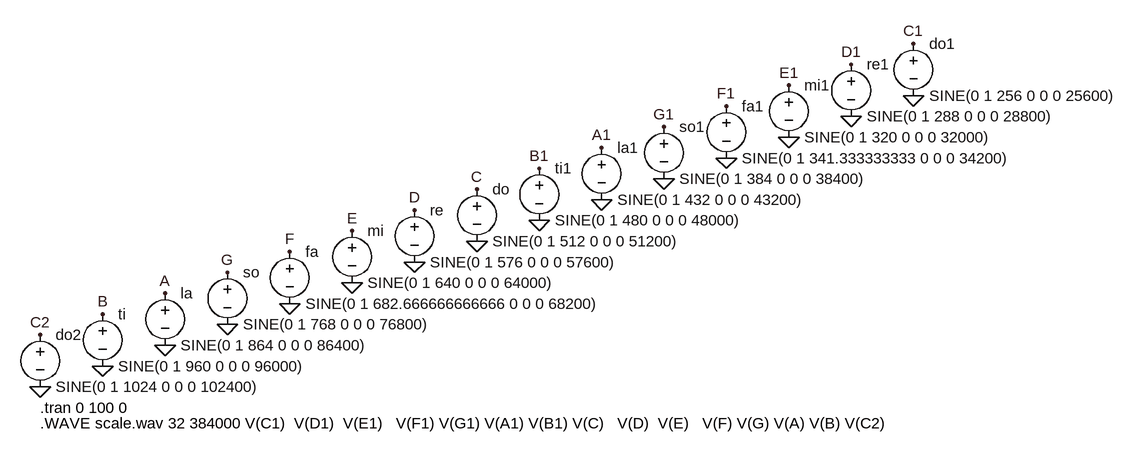
[diagram p0: schematic 2scales.asc]
2scales.asc, the LTspice schematic file:
Version 4
SHEET 1 1104 768
FLAG 96 416 0
FLAG 96 336 C
FLAG 0 368 D
FLAG -96 480 0
FLAG -96 400 E
FLAG -192 432 F
FLAG -288 544 0
FLAG -288 464 G
FLAG -384 496 A
FLAG -480 608 0
FLAG -480 528 B
FLAG -576 560 C2
FLAG 0 448 0
FLAG -192 512 0
FLAG -576 640 0
FLAG -384 576 0
FLAG 768 192 0
FLAG 768 112 C1
FLAG 672 144 D1
FLAG 576 256 0
FLAG 576 176 E1
FLAG 480 208 F1
FLAG 384 320 0
FLAG 384 240 G1
FLAG 288 272 A1
FLAG 192 384 0
FLAG 192 304 B1
FLAG 672 224 0
FLAG 480 288 0
FLAG 288 352 0
SYMBOL voltage 96 320 R0
WINDOW 123 0 0 Left 0
WINDOW 39 0 0 Left 0
SYMATTR InstName do
SYMATTR Value SINE(0 1 512 0 0 0 51200)
SYMBOL voltage 0 352 R0
WINDOW 123 0 0 Left 0
WINDOW 39 0 0 Left 0
SYMATTR InstName re
SYMATTR Value SINE(0 1 576 0 0 0 57600)
SYMBOL voltage -96 384 R0
WINDOW 123 0 0 Left 0
WINDOW 39 0 0 Left 0
SYMATTR InstName mi
SYMATTR Value SINE(0 1 640 0 0 0 64000)
SYMBOL voltage -192 416 R0
WINDOW 123 0 0 Left 0
WINDOW 39 0 0 Left 0
SYMATTR InstName fa
SYMATTR Value SINE(0 1 682.666666666666 0 0 0 68200)
SYMBOL voltage -288 448 R0
WINDOW 123 0 0 Left 0
WINDOW 39 0 0 Left 0
SYMATTR InstName so
SYMATTR Value SINE(0 1 768 0 0 0 76800)
SYMBOL voltage -384 480 R0
WINDOW 123 0 0 Left 0
WINDOW 39 0 0 Left 0
SYMATTR InstName la
SYMATTR Value SINE(0 1 864 0 0 0 86400)
SYMBOL voltage -480 512 R0
WINDOW 123 0 0 Left 0
WINDOW 39 0 0 Left 0
SYMATTR InstName ti
SYMATTR Value SINE(0 1 960 0 0 0 96000)
SYMBOL voltage -576 544 R0
WINDOW 123 0 0 Left 0
WINDOW 39 0 0 Left 0
SYMATTR InstName do2
SYMATTR Value SINE(0 1 1024 0 0 0 102400)
SYMBOL voltage 768 96 R0
WINDOW 123 0 0 Left 0
WINDOW 39 0 0 Left 0
SYMATTR InstName do1
SYMATTR Value SINE(0 1 256 0 0 0 25600)
SYMBOL voltage 672 128 R0
WINDOW 123 0 0 Left 0
WINDOW 39 0 0 Left 0
SYMATTR InstName re1
SYMATTR Value SINE(0 1 288 0 0 0 28800)
SYMBOL voltage 576 160 R0
WINDOW 123 0 0 Left 0
WINDOW 39 0 0 Left 0
SYMATTR InstName mi1
SYMATTR Value SINE(0 1 320 0 0 0 32000)
SYMBOL voltage 480 192 R0
WINDOW 123 0 0 Left 0
WINDOW 39 0 0 Left 0
SYMATTR InstName fa1
SYMATTR Value SINE(0 1 341.333333333 0 0 0 34200)
SYMBOL voltage 384 224 R0
WINDOW 123 0 0 Left 0
WINDOW 39 0 0 Left 0
SYMATTR InstName so1
SYMATTR Value SINE(0 1 384 0 0 0 38400)
SYMBOL voltage 288 256 R0
WINDOW 123 0 0 Left 0
WINDOW 39 0 0 Left 0
SYMATTR InstName la1
SYMATTR Value SINE(0 1 432 0 0 0 43200)
SYMBOL voltage 192 288 R0
WINDOW 123 0 0 Left 0
WINDOW 39 0 0 Left 0
SYMATTR InstName ti1
SYMATTR Value SINE(0 1 480 0 0 0 48000)
TEXT -576 672 Left 2 !.tran 0 100 0
TEXT -576 696 Left 2 !.WAVE scale.wav 32 384000 V(C1)  V(D1)  V(E1)   V(F1) V(G1) V(A1) V(B1) V(C)   V(D)  V(E)   V(F) V(G) V(A) V(B) V(C2)

The netlist it stands for:
* 2scales.asc
V§do C 0 SINE(0 1 512 0 0 0 51200)
V§re D 0 SINE(0 1 576 0 0 0 57600)
V§mi E 0 SINE(0 1 640 0 0 0 64000)
V§fa F 0 SINE(0 1 682.666666666666 0 0 0 68200)
V§so G 0 SINE(0 1 768 0 0 0 76800)
V§la A 0 SINE(0 1 864 0 0 0 86400)
V§ti B 0 SINE(0 1 960 0 0 0 96000)
V§do2 C2 0 SINE(0 1 1024 0 0 0 102400)
V§do1 C1 0 SINE(0 1 256 0 0 0 25600)
V§re1 D1 0 SINE(0 1 288 0 0 0 28800)
V§mi1 E1 0 SINE(0 1 320 0 0 0 32000)
V§fa1 F1 0 SINE(0 1 341.333333333 0 0 0 34200)
V§so1 G1 0 SINE(0 1 384 0 0 0 38400)
V§la1 A1 0 SINE(0 1 432 0 0 0 43200)
V§ti1 B1 0 SINE(0 1 480 0 0 0 48000)
.tran 0 100 0
.WAVE scale.wav 32 384000 V(C1)  V(D1)  V(E1)   V(F1) V(G1) V(A1) V(B1) V(C)   V(D)  V(E)   V(F) V(G) V(A) V(B) V(C2)
.backanno
.end